# Altium schematic sheet Sheet1.SchDoc
size A4; Author: Wojciech Gredel; CompanyName: AGH UST; Revision: 1; ProjectName: My_project1
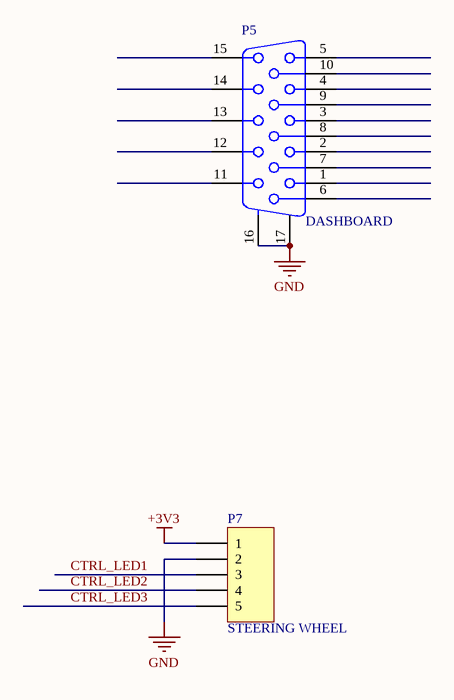
[diagram p0: Sheet1.SchDoc]

## Parts
P5  DASHBOARD  [050DSUB0.762-4H15]
P7  STEERING WHEEL  [MHDR1X5]

## Nets
+3V3: P7.1
GND: P5.16(MH1) P5.17(MH2) P7.2
CTRL_LED1: P7.3
CTRL_LED2: P7.4
CTRL_LED3: P7.5

Not connected (* = marked no-connect by the designer): P5 1 2 3 4 5 6 7 8 9 10 11 12 13 14 15

## Notes on the sheet
- Confidential / Not for distribution !
- Project name:
- Document name:
- Designer Name:
- Date/Time:
- Revision:

## Library data of the parts
P5 = D-SUB 15: 15-Pin, D-SUB Connector; PackageDocument: B; Positions: 15; Gender: Receptacle Header; Published: 15-Jun-2001; LatestRevisionDate: 17-Jul-2002; LatestRevisionNote: Re-released for DXP Platform.; DatasheetDocument: 24-Nov-1999; PackageReference: 788574; Publisher: Altium Limited; Orientation: Right Angle
P7 = MHDR1X5: ST1212/P5 5 pin waterproof connector; LatestRevisionDate: 17-Jul-2002; LatestRevisionNote: Re-released for DXP Platform.; Publisher: Altium Limited